# Altium schematic sheet bbb_blk.SchDoc
size A4; Engineer: JBayalas; DocumentNumber: 7; Revision: V2.0; SheetNumber: 7; SheetTotal: 14
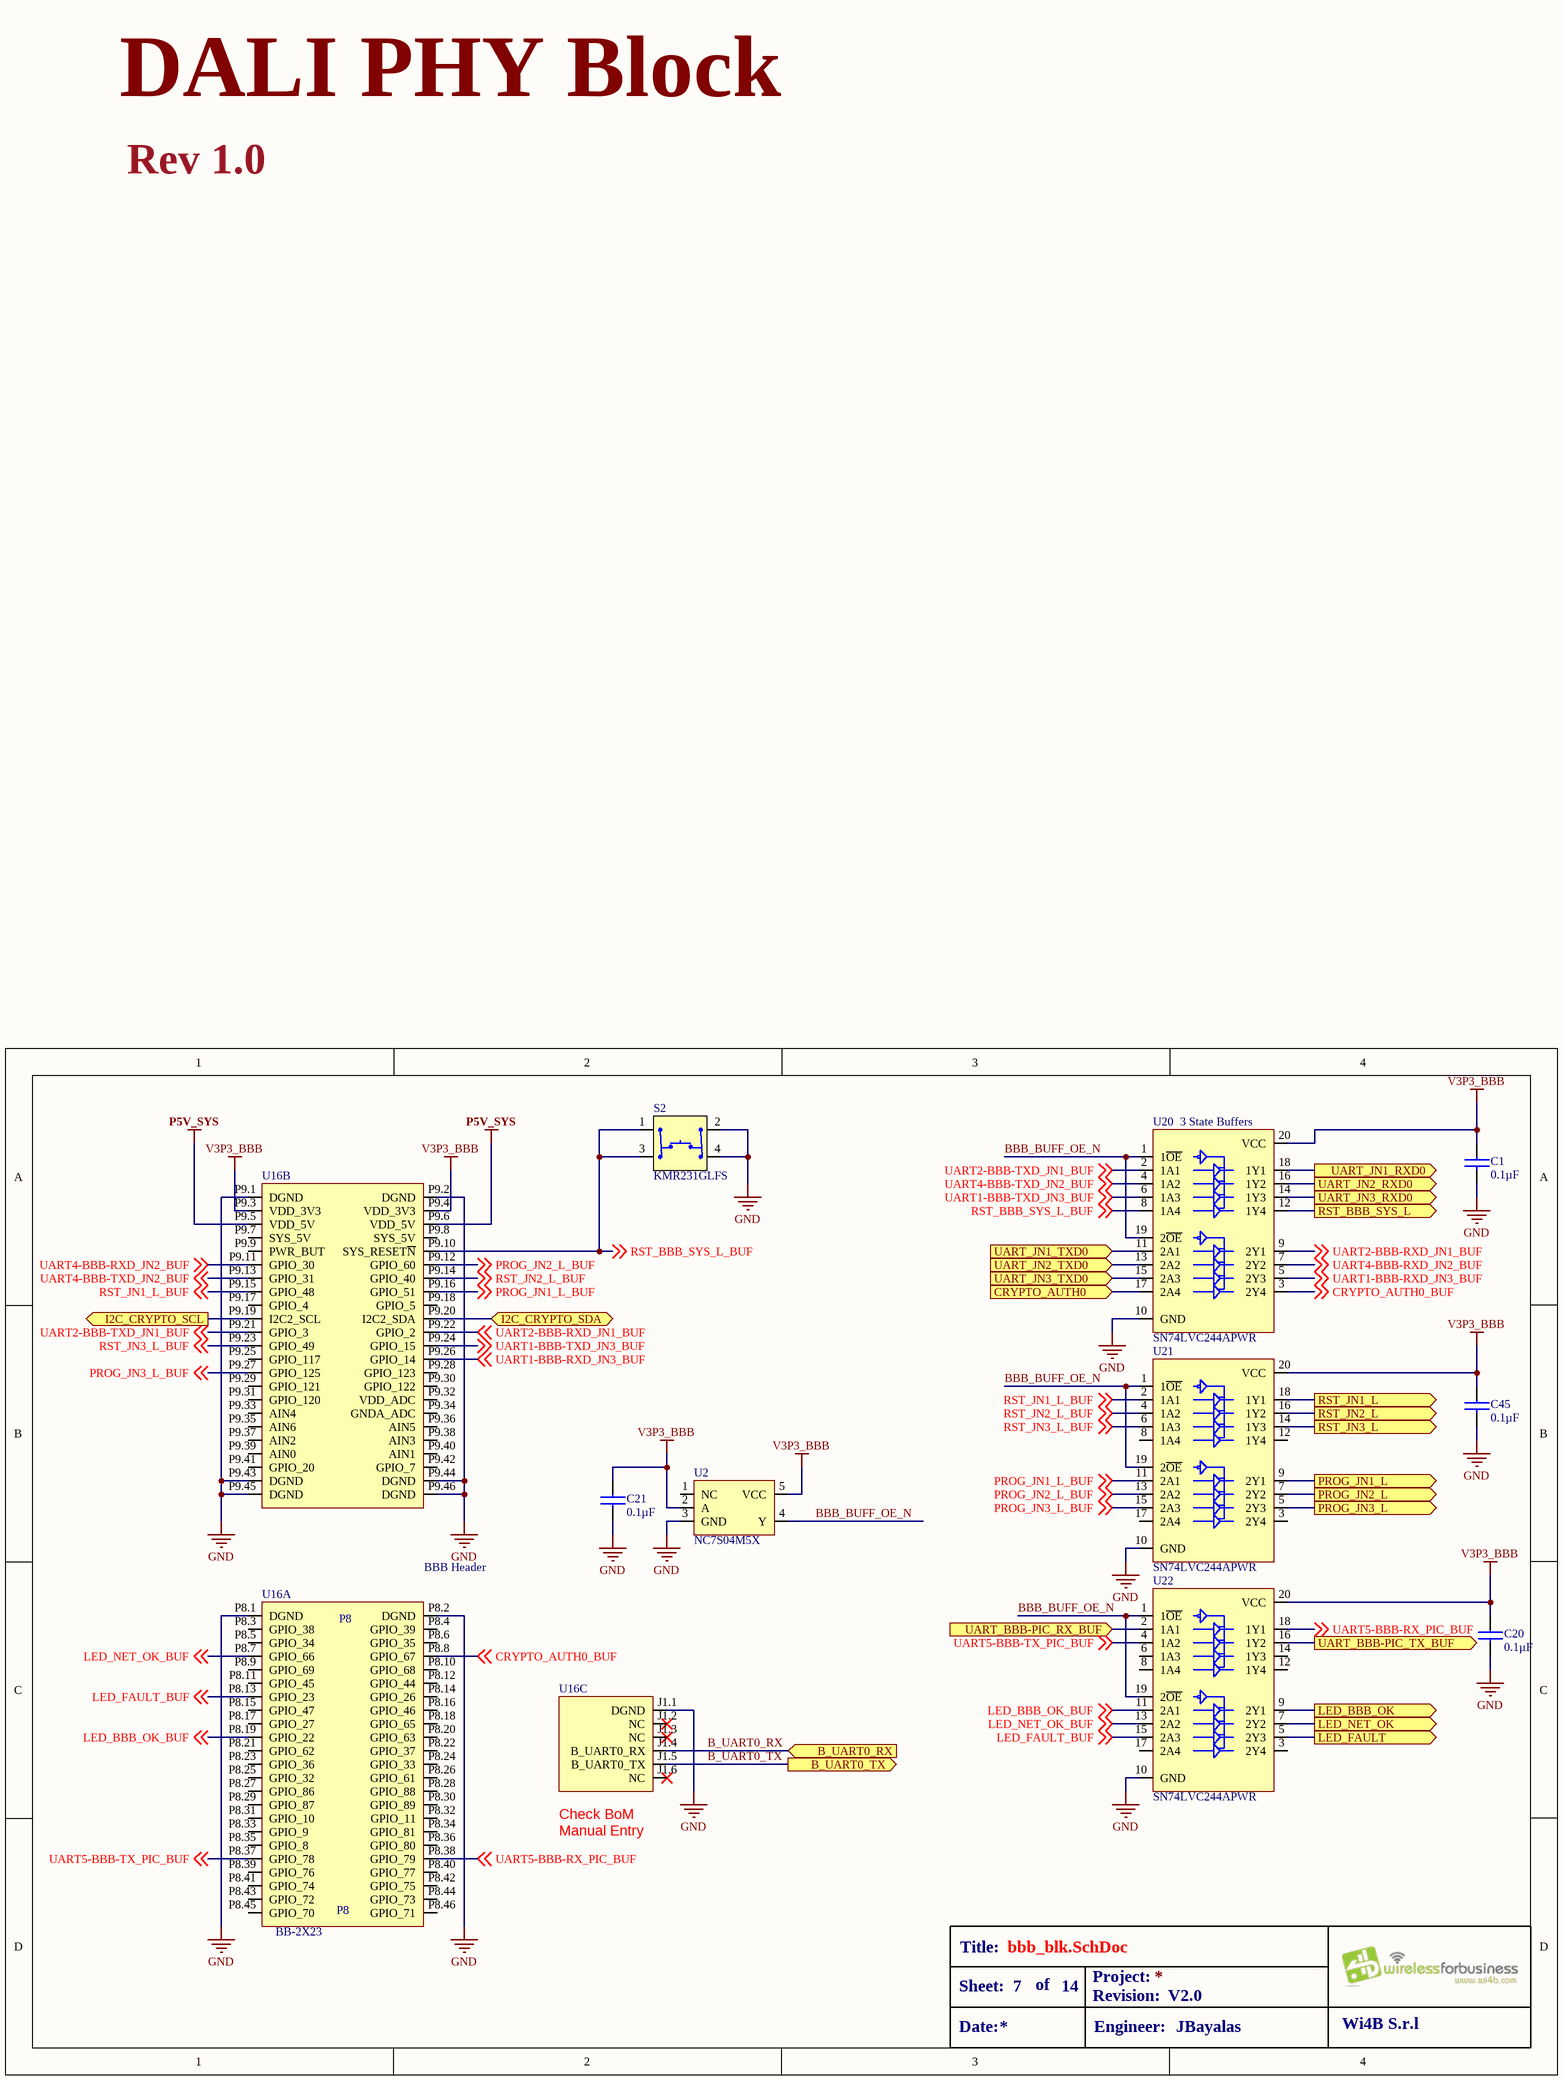
[diagram p0: bbb_blk.SchDoc]

## Parts
C1  value 0.1µF  [C0402]  (hidden comment: *)
C20  value 0.1µF  [C0402]  (hidden comment: *)
C21  value 0.1µF  [C0402]  (hidden comment: *)
C45  value 0.1µF  [C0402]  (hidden comment: *)
S2  *  [KMR231G ULC LFS]  (value not drawn)
U2  *  [SOT 23-5]  (value not drawn)
U16  MPN: BB-2X23  [BEAGLE_BONE_BLACK_CAPE]  (hidden comment: BEAGLE_BONE_BLACK_CAPE)  (parts A,B,C of 3)
U20  SN74LVC244APWR  [TSSOP-20 (SN74LVC)]
U21  SN74LVC244APWR  [TSSOP-20 (SN74LVC)]
U22  SN74LVC244APWR  [TSSOP-20 (SN74LVC)]

## Ports
B_UART0_RX (in), B_UART0_TX (out), CRYPTO_AUTH0 (in), I2C_CRYPTO_SCL (out), I2C_CRYPTO_SDA (bidir), LED_BBB_OK (out), LED_FAULT (out), LED_NET_OK (out), PROG_JN1_L (out), PROG_JN2_L (out), PROG_JN3_L (out), RST_BBB_SYS_L (out), RST_JN1_L (out), RST_JN2_L (out), RST_JN3_L (out), UART_BBB-PIC_RX_BUF (in), UART_BBB-PIC_TX_BUF (out), UART_JN1_RXD0 (out), UART_JN1_TXD0 (in), UART_JN2_RXD0 (out), UART_JN2_TXD0 (in), UART_JN3_RXD0 (out), UART_JN3_TXD0 (in)

## Nets
GND: C1.2 C20.2 C21.2 C45.2 S2.2 S2.4 U2.3(GND) U16.J1.1(DGND) U16.P8.1(DGND) U16.P8.2(DGND) U16.P9.1(DGND) U16.P9.2(DGND) U16.P9.43(DGND) U16.P9.44(DGND) U16.P9.45(DGND) U16.P9.46(DGND) U20.10(GND) U21.10(GND) U22.10(GND)
P5V_SYS: U16.P9.5(VDD_5V) U16.P9.6(VDD_5V)
V3P3_BBB: C1.1 C20.1 C21.1 C45.1 U2.2(A) U2.5(VCC) U16.P9.3(VDD_3V3) U16.P9.4(VDD_3V3) U20.20(VCC) U21.20(VCC) U22.20(VCC)
B_UART0_RX: U16.J1.4(B_UART0_RX) ; port B_UART0_RX
B_UART0_TX: U16.J1.5(B_UART0_TX) ; port B_UART0_TX
BBB_BUFF_OE_N: U2.4(Y) U20.1(1~{OE}) U20.19(2~{OE}) U21.1(1~{OE}) U21.19(2~{OE}) U22.1(1~{OE}) U22.19(2~{OE})
CRYPTO_AUTH0: U20.17(2A4) ; port CRYPTO_AUTH0
CRYPTO_AUTH0_BUF: U16.P8.8(GPIO_67) U20.3(2Y4) ; off-sheet CRYPTO_AUTH0_BUF
I2C_CRYPTO_SCL: U16.P9.19(I2C2_SCL) ; port I2C_CRYPTO_SCL
I2C_CRYPTO_SDA: U16.P9.20(I2C2_SDA) ; port I2C_CRYPTO_SDA
LED_BBB_OK: U22.9(2Y1) ; port LED_BBB_OK
LED_BBB_OK_BUF: U16.P8.19(GPIO_22) U22.11(2A1) ; off-sheet LED_BBB_OK_BUF
LED_FAULT: U22.5(2Y3) ; port LED_FAULT
LED_FAULT_BUF: U16.P8.13(GPIO_23) U22.15(2A3) ; off-sheet LED_FAULT_BUF
LED_NET_OK: U22.7(2Y2) ; port LED_NET_OK
LED_NET_OK_BUF: U16.P8.7(GPIO_66) U22.13(2A2) ; off-sheet LED_NET_OK_BUF
PROG_JN1_L: U21.9(2Y1) ; port PROG_JN1_L
PROG_JN1_L_BUF: U16.P9.16(GPIO_51) U21.11(2A1) ; off-sheet PROG_JN1_L_BUF
PROG_JN2_L: U21.7(2Y2) ; port PROG_JN2_L
PROG_JN2_L_BUF: U16.P9.12(GPIO_60) U21.13(2A2) ; off-sheet PROG_JN2_L_BUF
PROG_JN3_L: U21.5(2Y3) ; port PROG_JN3_L
PROG_JN3_L_BUF: U16.P9.27(GPIO_125) U21.15(2A3) ; off-sheet PROG_JN3_L_BUF
RST_BBB_SYS_L: U20.12(1Y4) ; port RST_BBB_SYS_L
RST_BBB_SYS_L_BUF: S2.1 S2.3 U16.P9.10(SYS_RESET~{N}) U20.8(1A4) ; off-sheet RST_BBB_SYS_L_BUF
RST_JN1_L: U21.18(1Y1) ; port RST_JN1_L
RST_JN1_L_BUF: U16.P9.15(GPIO_48) U21.2(1A1) ; off-sheet RST_JN1_L_BUF
RST_JN2_L: U21.16(1Y2) ; port RST_JN2_L
RST_JN2_L_BUF: U16.P9.14(GPIO_40) U21.4(1A2) ; off-sheet RST_JN2_L_BUF
RST_JN3_L: U21.14(1Y3) ; port RST_JN3_L
RST_JN3_L_BUF: U16.P9.23(GPIO_49) U21.6(1A3) ; off-sheet RST_JN3_L_BUF
UART1-BBB-RXD_JN3_BUF: U16.P9.26(GPIO_14) U20.5(2Y3) ; off-sheet UART1-BBB-RXD_JN3_BUF
UART1-BBB-TXD_JN3_BUF: U16.P9.24(GPIO_15) U20.6(1A3) ; off-sheet UART1-BBB-TXD_JN3_BUF
UART2-BBB-RXD_JN1_BUF: U16.P9.22(GPIO_2) U20.9(2Y1) ; off-sheet UART2-BBB-RXD_JN1_BUF
UART2-BBB-TXD_JN1_BUF: U16.P9.21(GPIO_3) U20.2(1A1) ; off-sheet UART2-BBB-TXD_JN1_BUF
UART4-BBB-RXD_JN2_BUF: U16.P9.11(GPIO_30) U20.7(2Y2) ; off-sheet UART4-BBB-RXD_JN2_BUF
UART4-BBB-TXD_JN2_BUF: U16.P9.13(GPIO_31) U20.4(1A2) ; off-sheet UART4-BBB-TXD_JN2_BUF
UART5-BBB-RX_PIC_BUF: U16.P8.38(GPIO_79) U22.18(1Y1) ; off-sheet UART5-BBB-RX_PIC_BUF
UART5-BBB-TX_PIC_BUF: U16.P8.37(GPIO_78) U22.4(1A2) ; off-sheet UART5-BBB-TX_PIC_BUF
UART_BBB-PIC_RX_BUF: U22.2(1A1) ; port UART_BBB-PIC_RX_BUF
UART_BBB-PIC_TX_BUF: U22.16(1Y2) ; port UART_BBB-PIC_TX_BUF
UART_JN1_RXD0: U20.18(1Y1) ; port UART_JN1_RXD0
UART_JN1_TXD0: U20.11(2A1) ; port UART_JN1_TXD0
UART_JN2_RXD0: U20.16(1Y2) ; port UART_JN2_RXD0
UART_JN2_TXD0: U20.13(2A2) ; port UART_JN2_TXD0
UART_JN3_RXD0: U20.14(1Y3) ; port UART_JN3_RXD0
UART_JN3_TXD0: U20.15(2A3) ; port UART_JN3_TXD0

Not connected (* = marked no-connect by the designer): U2 1(NC); U16 J1.2(NC)* J1.3(NC)* J1.6(NC)* P8.3(GPIO_38) P8.4(GPIO_39) P8.5(GPIO_34) P8.6(GPIO_35) P8.9(GPIO_69) P8.10(GPIO_68) P8.11(GPIO_45) P8.12(GPIO_44) P8.14(GPIO_26) P8.15(GPIO_47) P8.16(GPIO_46) P8.17(GPIO_27) P8.18(GPIO_65) P8.20(GPIO_63) P8.21(GPIO_62) P8.22(GPIO_37) P8.23(GPIO_36) P8.24(GPIO_33) P8.25(GPIO_32) P8.26(GPIO_61) P8.27(GPIO_86) P8.28(GPIO_88) P8.29(GPIO_87) P8.30(GPIO_89) P8.31(GPIO_10) P8.32(GPIO_11) P8.33(GPIO_9) P8.34(GPIO_81) P8.35(GPIO_8) P8.36(GPIO_80) P8.39(GPIO_76) P8.40(GPIO_77) P8.41(GPIO_74) P8.42(GPIO_75) P8.43(GPIO_72) P8.44(GPIO_73) P8.45(GPIO_70) P8.46(GPIO_71) P9.7(SYS_5V) P9.8(SYS_5V) P9.9(PWR_BUT) P9.17(GPIO_4) P9.18(GPIO_5) P9.25(GPIO_117) P9.28(GPIO_123) P9.29(GPIO_121) P9.30(GPIO_122) P9.31(GPIO_120) P9.32(VDD_ADC) P9.33(AIN4) P9.34(GNDA_ADC) P9.35(AIN6) P9.36(AIN5) P9.37(AIN2) P9.38(AIN3) P9.39(AIN0) P9.40(AIN1) P9.41(GPIO_20) P9.42(GPIO_7); U21 3(2Y4) 8(1A4) 12(1Y4) 17(2A4); U22 3(2Y4) 6(1A3) 8(1A4) 12(1Y4) 14(1Y3) 17(2A4)

## Notes on the sheet
- DALI PHY Block
- Rev 1.0
- (near U20) 3 State Buffers
- (near U16) BBB Header
- (near U16) Check BoM Manual Entry
- Title:
- Sheet:
- Date:
- of
- Project:
- Revision:
- Engineer:
- Wi4B S.r.l
- (in symbol BEAGLE_BONE_BLACK_CAPE, part A) P8

## Library data of the parts
C1 C20 C21 C45 = CL05B104KO3LNNC: CAP CER 0.1UF 16V X7R 0402; MFT: Samsung Electro-Mechanics America, Inc.; RATING: ±10%, 16V; TYPE: Surface Mount, MLCC; FUNCTION: BBB; MPN: CL05B104KO3LNNC
S2 = KMR231GLFS: SWITCH TACTILE SPST-NO 0.05A 32V; MFT: C&K Components; FUNCTION: BBB; VALUE: KMR231GLFS; TYPE: SMD; MPN: KMR231GLFS
U2 = NC7S04M5X: IC INVERTER HS SINGLE SOT-23-5; MFT: ON Semiconductor; FUNCTION: BBB; LOAD: *; RATING: *; TYPE: SMD; VALUE: NC7S04M5X; MPN: NC7S04M5X
U16 = BEAGLE_BONE_BLACK_CAPE: Beaglebone 2x23 Pin stacking header(2 Pack ); MFT: Microrobotics; VALUE: BB-2X23; FUNCTION: BBB; TYPE: SMD; RATING: *; LOAD: *
U20-U22 = SN74LVC244APWR: IC BUFF/DVR TRI-ST DUAL 20TSSOP; MFT: Texas Instruments; FUNCTION: BBB; MPN: SN74LVC244APWR; TYPE: SMD; RATING: *; LOAD: *; VALUE: SN74LVC244APWR